# EAGLE design Ventouse (EAGLE 9.6.2)
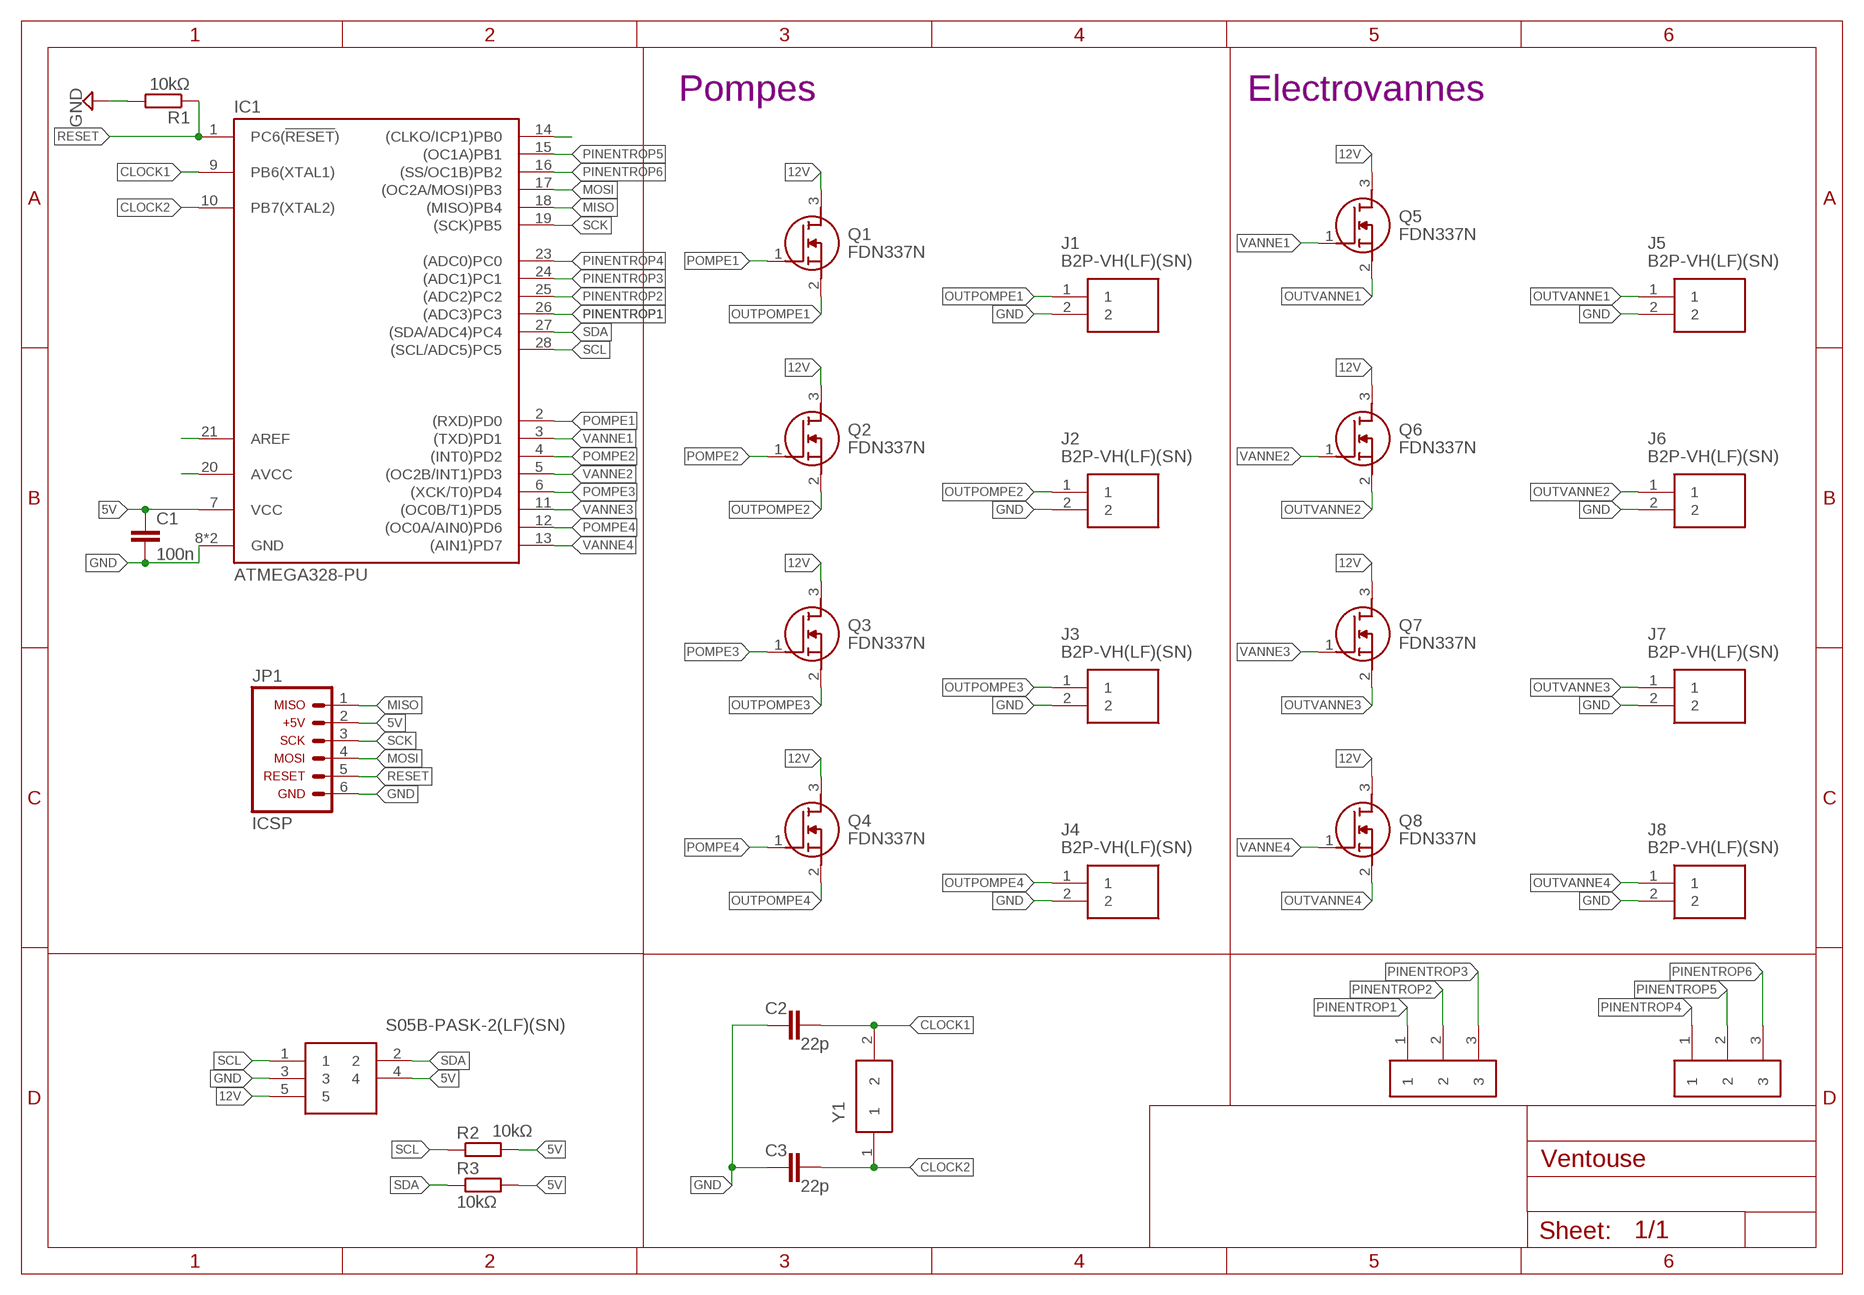
[diagram p0: schematic, sheet 1]

## Parts
C1  100n  C-EUC0805  [C0805]
C2  22p  C-EUC0805  [C0805]
C3  22p  C-EUC0805  [C0805]
IC1  ATMEGA328-PU  [DIL28]
J1  B2P-VH(LF)(SN)  [SHDR2W114P0X396_1X2_786X850X94]
J2  B2P-VH(LF)(SN)  [SHDR2W114P0X396_1X2_786X850X94]
J3  B2P-VH(LF)(SN)  [SHDR2W114P0X396_1X2_786X850X94]
J4  B2P-VH(LF)(SN)  [SHDR2W114P0X396_1X2_786X850X94]
J5  B2P-VH(LF)(SN)  [SHDR2W114P0X396_1X2_786X850X94]
J6  B2P-VH(LF)(SN)  [SHDR2W114P0X396_1X2_786X850X94]
J7  B2P-VH(LF)(SN)  [SHDR2W114P0X396_1X2_786X850X94]
J8  B2P-VH(LF)(SN)  [SHDR2W114P0X396_1X2_786X850X94]
JP1  ARDUINO_CONN-ICSP  [CONN-2X03]
Q1  FDN337N  [SOT95P237X112-3N]
Q2  FDN337N  [SOT95P237X112-3N]
Q3  FDN337N  [SOT95P237X112-3N]
Q4  FDN337N  [SOT95P237X112-3N]
Q5  FDN337N  [SOT95P237X112-3N]
Q6  FDN337N  [SOT95P237X112-3N]
Q7  FDN337N  [SOT95P237X112-3N]
Q8  FDN337N  [SOT95P237X112-3N]
R1  10kΩ  R-EU_R0805  [R0805]
R2  10kΩ  R-EU_R0805  [R0805]
R3  10kΩ  R-EU_R0805  [R0805]
SCL  S05B-PASK-2(LF)(SN)  [S05B-PASK-2(LF)(SN)]
U$1  HEADER3PIN  [HEADER3PINFOOTPRINT]
U$2  HEADER3PIN  [HEADER3PINFOOTPRINT]
Y1  XRCHA16M000F0A01R0  [XRCHA]

## Nets
5V: C1.1 IC1.7(VCC) JP1.2 R2.2 R3.2 SCL.4
12V: Q1.3(D) Q2.3(D) Q3.3(D) Q4.3(D) Q5.3(D) Q6.3(D) Q7.3(D) Q8.3(D) SCL.5
CLOCK1: C2.2 IC1.9(PB6(XTAL1)) Y1.2
CLOCK2: C3.2 IC1.10(PB7(XTAL2)) Y1.1
GND: C1.2 C2.1 C3.1 IC1.8(GND) IC1.22(GND) J1.2 J2.2 J3.2 J4.2 J5.2 J6.2 J7.2 J8.2 JP1.6 R1.2 SCL.3
MISO: IC1.18((MISO)PB4) JP1.1
MOSI: IC1.17((OC2A/MOSI)PB3) JP1.4
N$8: IC1.14((CLKO/ICP1)PB0)
OUTPOMPE1: J1.1 Q1.2(S)
OUTPOMPE2: J2.1 Q2.2(S)
OUTPOMPE3: J3.1 Q3.2(S)
OUTPOMPE4: J4.1 Q4.2(S)
OUTVANNE1: J5.1 Q5.2(S)
OUTVANNE2: J6.1 Q6.2(S)
OUTVANNE3: J7.1 Q7.2(S)
OUTVANNE4: J8.1 Q8.2(S)
PINENTROP1: IC1.26((ADC3)PC3) U$1.1
PINENTROP2: IC1.25((ADC2)PC2) U$1.2
PINENTROP3: IC1.24((ADC1)PC1) U$1.3
PINENTROP4: IC1.23((ADC0)PC0) U$2.1
PINENTROP5: IC1.15((OC1A)PB1) IC1.21(AREF) U$2.2
PINENTROP6: IC1.16((SS/OC1B)PB2) IC1.20(AVCC) U$2.3
POMPE1: IC1.2((RXD)PD0) Q1.1(G)
POMPE2: IC1.4((INT0)PD2) Q2.1(G)
POMPE3: IC1.6((XCK/T0)PD4) Q3.1(G)
POMPE4: IC1.12((OC0A/AIN0)PD6) Q4.1(G)
RESET: IC1.1(PC6(!RESET!)) JP1.5 R1.1
SCK: IC1.19((SCK)PB5) JP1.3
SCL: IC1.28((SCL/ADC5)PC5) R2.1 SCL.1
SDA: IC1.27((SDA/ADC4)PC4) R3.1 SCL.2
VANNE1: IC1.3((TXD)PD1) Q5.1(G)
VANNE2: IC1.5((OC2B/INT1)PD3) Q6.1(G)
VANNE3: IC1.11((OC0B/T1)PD5) Q7.1(G)
VANNE4: IC1.13((AIN1)PD7) Q8.1(G)

## Notes on the sheet
- Pompes | Electrovannes

## Library data of the parts
C1-C3 = INTech:C-EU: CAPACITOR, European symbol; SPICEPREFIX: C
IC1 = INTech:ATMEGA328-PU: Atmel ATmega48/88/168/328 AVR Microcontroller; AVAILABILITY: Unavailable; DESCRIPTION: AVR AVR® ATmega Microcontroller IC 8-Bit 20MHz 32KB _16K x 16_ FLASH 28-PDIP; MF: Microchip Technology; MP: ATMEGA328-PU; PACKAGE: DIP-28 Microchip Technology; PRICE: None
J1-J8 = INTech:B2P-VH(LF)(SN): connector,multipole PCB use,B2P-VH,VH se JST VH Series, 3.96mm Pitch 2 Way 1 Row Straight PCB Header, Solder Termination, 10A Source: Datasheet <http://www.jst-mfg.com/product/pdf/eng/eVH.pdf>; DESCRIPTION: connector,multipole PCB use,B2P-VH,VH se JST VH Series, 3.96mm Pitch 2 Way 1 Row Straight PCB Header, Solder Termination, 10A; HEIGHT: 9.4mm; MANUFACTURER_NAME: JST (JAPAN SOLDERLESS TERMINALS); MANUFACTURER_PART_NUMBER: B2P-VH(LF)(SN); RS_PART_NUMBER: 8201147P; RS_PRICE-STOCK: http://uk.rs-online.com/web/p/products/8201147P
JP1 = INTech:ARDUINO_CONN-ICSP: Arduino ICSP I/O Header This is the ICSP I/O header on the Arduino Uno R3. This connector is labeled with the following pin assignments: MISO +5V SCK MOSI RESET GND NOTE: Be sure you install this connector with the correct orientation on your PCB layout. Pin 1 has a square pad to assist with orientation.
Q1-Q8 = INTech:FDN337N: FDN337N N-Channel MOSFET, 2.2 A, 30 V, 3-Pin SOT-23 ON Semiconductor Source: Datasheet <https://www.onsemi.com/pub/Collateral/FDN337N-D.PDF>; DESCRIPTION: FDN337N N-Channel MOSFET, 2.2 A, 30 V, 3-Pin SOT-23 ON Semiconductor; HEIGHT: 1.12mm; MANUFACTURER_NAME: ON Semiconductor; MANUFACTURER_PART_NUMBER: FDN337N; MOUSER_PART_NUMBER: 512-FDN337N; MOUSER_PRICE-STOCK: https://www.mouser.com/Search/Refine.aspx?Keyword=512-FDN337N; RS_PART_NUMBER: 6710429P; RS_PRICE-STOCK: http://uk.rs-online.com/web/p/products/6710429P
R1-R3 = INTech:R-EU_: RESISTOR, European symbol; SPICEPREFIX: R
SCL = INTech:S05B-PASK-2(LF)(SN): CONN HEADER PA 5POS SIDE 2MM TIN Source: Datasheet <http://www.jst-mfg.com/product/pdf/eng/ePA-F.pdf>; DESCRIPTION: CONN HEADER PA 5POS SIDE 2MM TIN; HEIGHT: mm; MANUFACTURER_NAME: JST (JAPAN SOLDERLESS TERMINALS); MANUFACTURER_PART_NUMBER: S05B-PASK-2(LF)(SN)
U$1 U$2 = INTech:HEADER3PIN
Y1 = INTech:XRCHA16M000F0A01R0: Crystal Unit for Automotive, 16.0000 MHz, 100 ESR, 8pF Source: Datasheet <http://www.murata.com/~/media/webrenewal/products/timingdevice/crystalu/flyers/vppt-hcrj078-d.ashx?la=en-us>; DESCRIPTION: Crystal Unit for Automotive, 16.0000 MHz, 100 ESR, 8pF; HEIGHT: mm; MANUFACTURER_NAME: Murata Electronics; MANUFACTURER_PART_NUMBER: XRCHA16M000F0A01R0; MOUSER_PART_NUMBER: 81-XRCHA16M000F0A1R0; MOUSER_PRICE-STOCK: https://www.mouser.com/Search/Refine.aspx?Keyword=81-XRCHA16M000F0A1R0; RS_PART_NUMBER: 1446622; RS_PRICE-STOCK: http://uk.rs-online.com/web/p/products/1446622

## Board
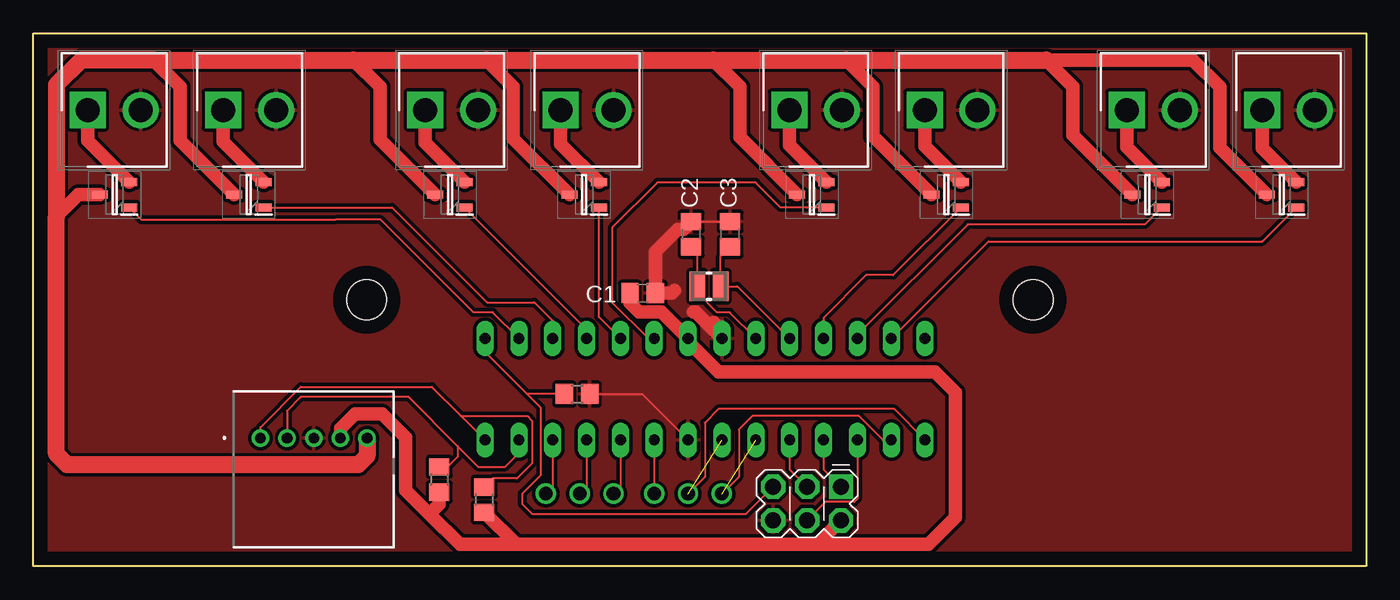
[diagram p1: board, top side]
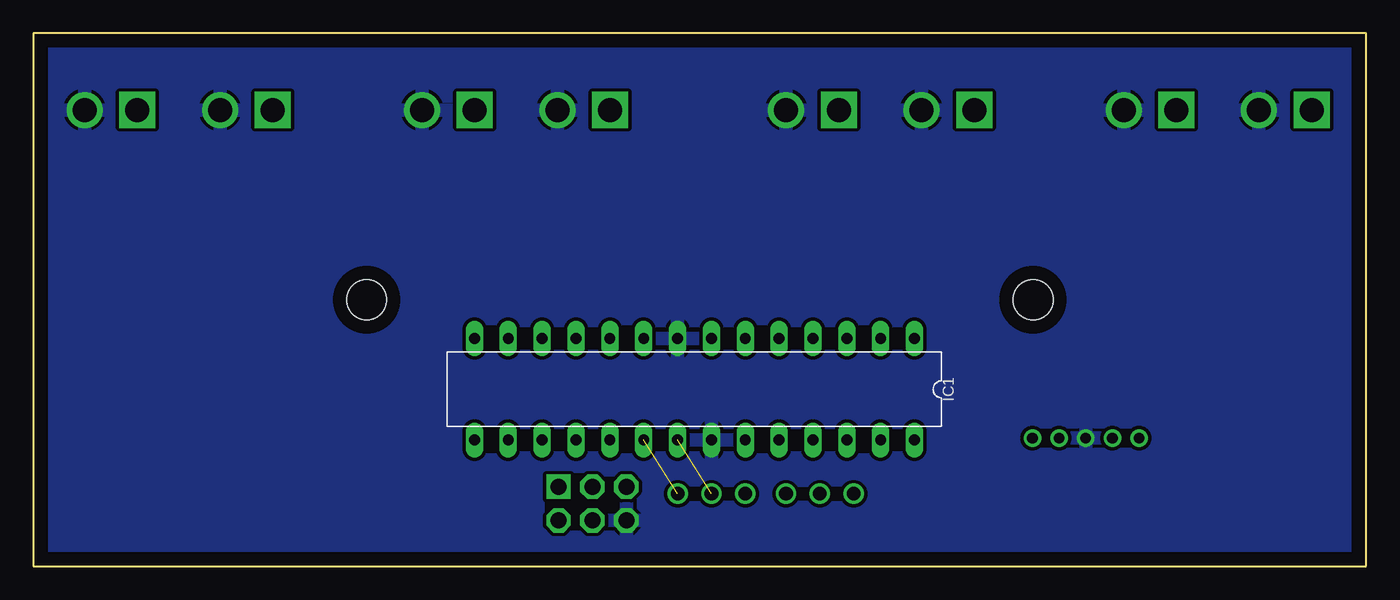
[diagram p2: board, bottom side, seen from below]

Size 100 x 40 mm. Coordinates in mm from the lower left corner, seen from the top.
Outline: 0,40 100,40 100,0 0,0 0,40
Copper layers (1*16): Top 0.035mm / dielectric 1.5mm / Bottom 0.035mm
Design rules "default *": minimum track width 6mil, minimum drill 0.35mm, track to track 10mil, track to pad 10mil, pad to pad 10mil, via to via 10mil, smd to smd 10mil, copper to edge 40mil, drill to drill 6mil, minimum pad ring 10mil, minimum via ring 8mil, stop-mask expansion 4mil, vias tented up to drill 0mil, thermal gap 10mil
Holes 3 mm at 25,20 75,20

### Footprints (pad centres in the part's own frame; a part is rotated, then mirrored left to right if it is on the bottom)
C0805 = smd 1.3 x 1.5: 1 -0.95,0; 2 0.95,0
DIL28 = drill 0.813 long: 1 -3.81,16.51; 2 -3.81,13.97; 3 -3.81,11.43; 4 -3.81,8.89; 5 -3.81,6.35; 6 -3.81,3.81; 7 -3.81,1.27; 8 -3.81,-1.27; 9 -3.81,-3.81; 10 -3.81,-6.35; 11 -3.81,-8.89; 12 -3.81,-11.43; 13 -3.81,-13.97; 14 -3.81,-16.51; 15 3.81,-16.51; 16 3.81,-13.97; 17 3.81,-11.43; 18 3.81,-8.89; 19 3.81,-6.35; 20 3.81,-3.81; 21 3.81,-1.27; 22 3.81,1.27; 23 3.81,3.81; 24 3.81,6.35; 25 3.81,8.89; 26 3.81,11.43; 27 3.81,13.97; 28 3.81,16.51
SHDR2W114P0X396_1X2_786X850X94 = drill 1.8 pad 2.7 square: 1 0,0 | drill 1.8 pad 2.7: 2 3.96,0
CONN-2X03 = drill 1.2 pad 1.829 square: 1 0,0 | drill 1.2 pad 1.829 octagon: 2 2.54,0; 3 0,-2.54; 4 2.54,-2.54; 5 0,-5.08; 6 2.54,-5.08
SOT95P237X112-3N = smd 1.2 x 0.6: 1 -1.1,0.95; 2 -1.1,-0.95; 3 1.1,0
R0805 = smd 1.3 x 1.5: 1 -0.95,0; 2 0.95,0
S05B-PASK-2(LF)(SN) = drill 0.8 pad 1.3: 1 4,-2.1; 2 2,-2.1; 3 0,-2.1; 4 -2,-2.1; 5 -4,-2.1
HEADER3PINFOOTPRINT = drill 1.02: 1 0,2.54; 2 0,0; 3 0,-2.54
XRCHA = smd 1.15 x 2.2: 1 -0.875,0; 2 0.875,0

### Placement (x,y rotation side)
C1  45.72,20.5 0 top
C2  49.35,24.92 270 top
C3  52.27,24.92 270 top
IC1  50.4,13.28 270 bottom
J1  4.08,34.25 0 top
J2  29.4,34.25 0 top
J3  56.72,34.25 0 top
J4  82.04,34.25 0 top
J5  14.24,34.25 0 top
J6  39.56,34.25 0 top
J7  66.88,34.25 0 top
J8  92.2,34.25 0 top
JP1  60.59,5.97 270 top
Q1  6.09,27.88 180 top
Q2  31.25,27.88 180 top
Q3  58.41,27.88 180 top
Q4  83.57,27.88 180 top
Q5  16.17,27.88 180 top
Q6  41.33,27.88 180 top
Q7  68.49,27.88 180 top
Q8  93.65,27.88 180 top
R1  40.8,12.92 0 top
R2  33.83,5 270 top
R3  30.46,6.51 270 top
SCL  21.04,7.52 180 top
U$1  40.99,5.44 90 top
U$2  49.12,5.44 90 top
Y1  50.69,21.01 180 top

### Tracks (layer width: path | path; a pad name or v marks a point on that pad's centre or on a via)
5V
  Top 0.152: IC1.7 49.13,17.12 | 44.75,20.48 C1.1
  Top 1.016: 29.74,3.91 32.02,1.63 36.25,1.63 | 36.25,1.63 58.79,1.63 | 58.79,1.63 67.15,1.63 69.18,3.66 69.18,13.06 67.66,14.58 51.4,14.58 49.13,16.86 49.13,17.12 | 58.79,1.63 JP1.2 | 29.74,3.91 30.46,4.63 R3.2 | R2.2 36.25,1.63 | 29.74,3.91 27.94,5.71 27.94,9.65 26.16,11.43 24.13,11.43 23.04,10.34 SCL.4 | IC1.7 47.15,19.07 45.45,19.07 44.77,19.75 C1.1
12V
  Top 1.016: Q5.3 11,31.95 11,36 9,38 | Q1.3 3.35,27.88 1.73,26.25 | Q2.3 26,32.03 26,36 24,38 | Q6.3 36,32.11 36,36 34,38 | Q3.3 53,32.19 53,36 51,38 | Q7.3 63,32.27 63,36 61,38 | Q4.3 78,32.35 78,36 76,38 87,38 89,36 89,34.09 89.01,34.08 89.01,31.42 Q8.3
  Top 1.27: 76,38 61,38 51,38 34,38 24,38 9,38 3.6,38 1.73,36.13 1.73,26.25 1.73,8.43 2.54,7.62 24.38,7.62 25.04,8.28 SCL.5
CLOCK1
  Top 0.152: 49.38,20.57 Y1.2 | Y1.2 49.81,23.5 C2.2 | IC1.9 52.25,19.05 51.31,19.05 49.81,20.54 Y1.2
CLOCK2
  Top 0.152: 51.92,20.66 Y1.1 | Y1.1 51.56,23.27 C3.2 | Y1.1 52.83,21.01 IC1.10
GND
  Top 0.152: C3.1 C2.1 49.18,25.7 | R1.2 45.67,12.92 IC1.22
  Top 1.016: 46.84,20.33 C1.2 | 49.18,25.7 48.76,25.28 48.33,25.28 46.67,23.62 C1.2 | C1.2 47.92,20.5 48.1,20.68 | 51.05,18.29 51.05,17.7 IC1.8 49.69,19.07 49.53,19.07
  pour Bottom: -6.76,48.36 101.19,48.36 111.6,37.95 111.6,-10.82 99.41,-23.01 4.92,-23.01 -9.05,-9.04 -9.05,45.82 -6.76,48.11
  pour Top: 49.12,18.39 52.16,18.39 54.2,20.42 54.2,27.03 53.18,28.04 48.1,28.04 47.08,27.03 47.08,20.42
  pour Top: 0,45 100,45 105,40 105,0 100,-5 0,-5 -5,0 -5,40
MISO
  Top 0.152: IC1.18 59.29,7.28 JP1.1
MOSI
  Top 0.152: JP1.4 59.45,4.83 61.6,4.83 61.83,5.05 IC1.17
OUTPOMPE1
  Top 1.016: Q1.2 4.08,31.94 J1.1
OUTPOMPE2
  Top 1.016: Q2.2 29.4,31.78 J2.1
OUTPOMPE3
  Top 1.016: Q3.2 56.72,31.62 J3.1
OUTPOMPE4
  Top 1.016: Q4.2 82.04,31.46 J4.1
OUTVANNE1
  Top 1.016: Q5.2 14.24,31.86 J5.1
OUTVANNE2
  Top 1.016: Q6.2 39.56,31.7 J6.1
OUTVANNE3
  Top 1.016: Q7.2 66.88,31.54 J7.1
OUTVANNE4
  Top 1.016: Q8.2 92.2,31.38 J8.1
PINENTROP1
  Top 0.152: IC1.26 38.97,5.96 U$1.1
PINENTROP2
  Top 0.152: IC1.25 41.51,5.96 U$1.2
PINENTROP3
  Top 0.152: IC1.24 44.05,5.96 U$1.3
PINENTROP4
  Top 0.152: IC1.23 U$2.1
PINENTROP5  (1 unrouted)
  Top 0.152: IC1.15 64.59,11.79 51.4,11.79 50.39,10.77 50.39,6.71 U$2.2
PINENTROP6  (1 unrouted)
  Top 0.152: IC1.16 63.74,9.47 61.93,11.28 53.94,11.28 52.93,10.26 52.93,6.71 U$2.3
POMPE1
  Top 0.152: Q1.1 8.11,26.01 22.61,26.01 22.68,26.01 26.06,26.01 33.02,19.05 34.47,19.05 IC1.2
POMPE2
  Top 0.152: Q2.1 36.62,22.66 36.68,22.6 41.51,17.77 IC1.4
POMPE3
  Top 0.152: Q3.1 56.07,26.93 54.2,28.81 46.83,28.81 43.43,25.41 43.43,19.81 46.16,17.09 IC1.6
POMPE4
  Top 0.152: Q4.1 83.86,26.12 83.75,26.01 83.39,25.65 70.1,25.65 61.83,17.38 IC1.12
RESET
  Top 0.152: IC1.1 33.89,16.1 37.06,12.92 | 37.06,12.92 38.07,11.91 38.07,6.83 36.67,5.44 36.67,4.68 37.43,3.91 53.46,3.91 JP1.5 | R1.1 37.06,12.92
SCK
  Top 0.152: IC1.19 56.75,7.28 JP1.3
SCL
  Top 0.152: IC1.28 32.09,11.27 | 32.09,11.27 37.07,11.27 37.43,10.9 37.43,7.72 36.29,6.58 34.46,6.58 R2.1 | SCL.1 17.04,10.44 20.07,13.46 29.89,13.46 32.09,11.27
SDA
  Top 0.152: IC1.27 36.43,8.5 35.4,7.47 33.37,7.47 31.85,8.99 31.83,9.01 | 31.83,9.01 31.83,8.22 31.07,7.46 R3.1 | 31.83,9.01 28.14,12.7 20.07,12.7 19.04,11.68 SCL.2
VANNE1
  Top 0.152: IC1.3 38.97,18.44 37.59,19.81 34.04,19.81 26.92,26.93 Q5.1
VANNE2
  Top 0.152: IC1.5 42.43,18.71 Q6.1
VANNE3
  Top 0.152: Q7.1 64.5,21.84 62.48,21.84 59.29,18.65 IC1.11
VANNE4
  Top 0.152: IC1.13 71.66,24.38 92.2,24.38 Q8.1

### Text on the board
tValues: D0 | D1 | D2 | D3 | D4 | D5 | D6 | D7 | 16 MHz | SUUS | A3 | A2 | A1 | A0 | D9 | D10 | SCL | SDA | GND | 5V | 12V
bValues: SUUS